# EAGLE design EthernetGCS (EAGLE 6.1)

## Sheet 1 of 2
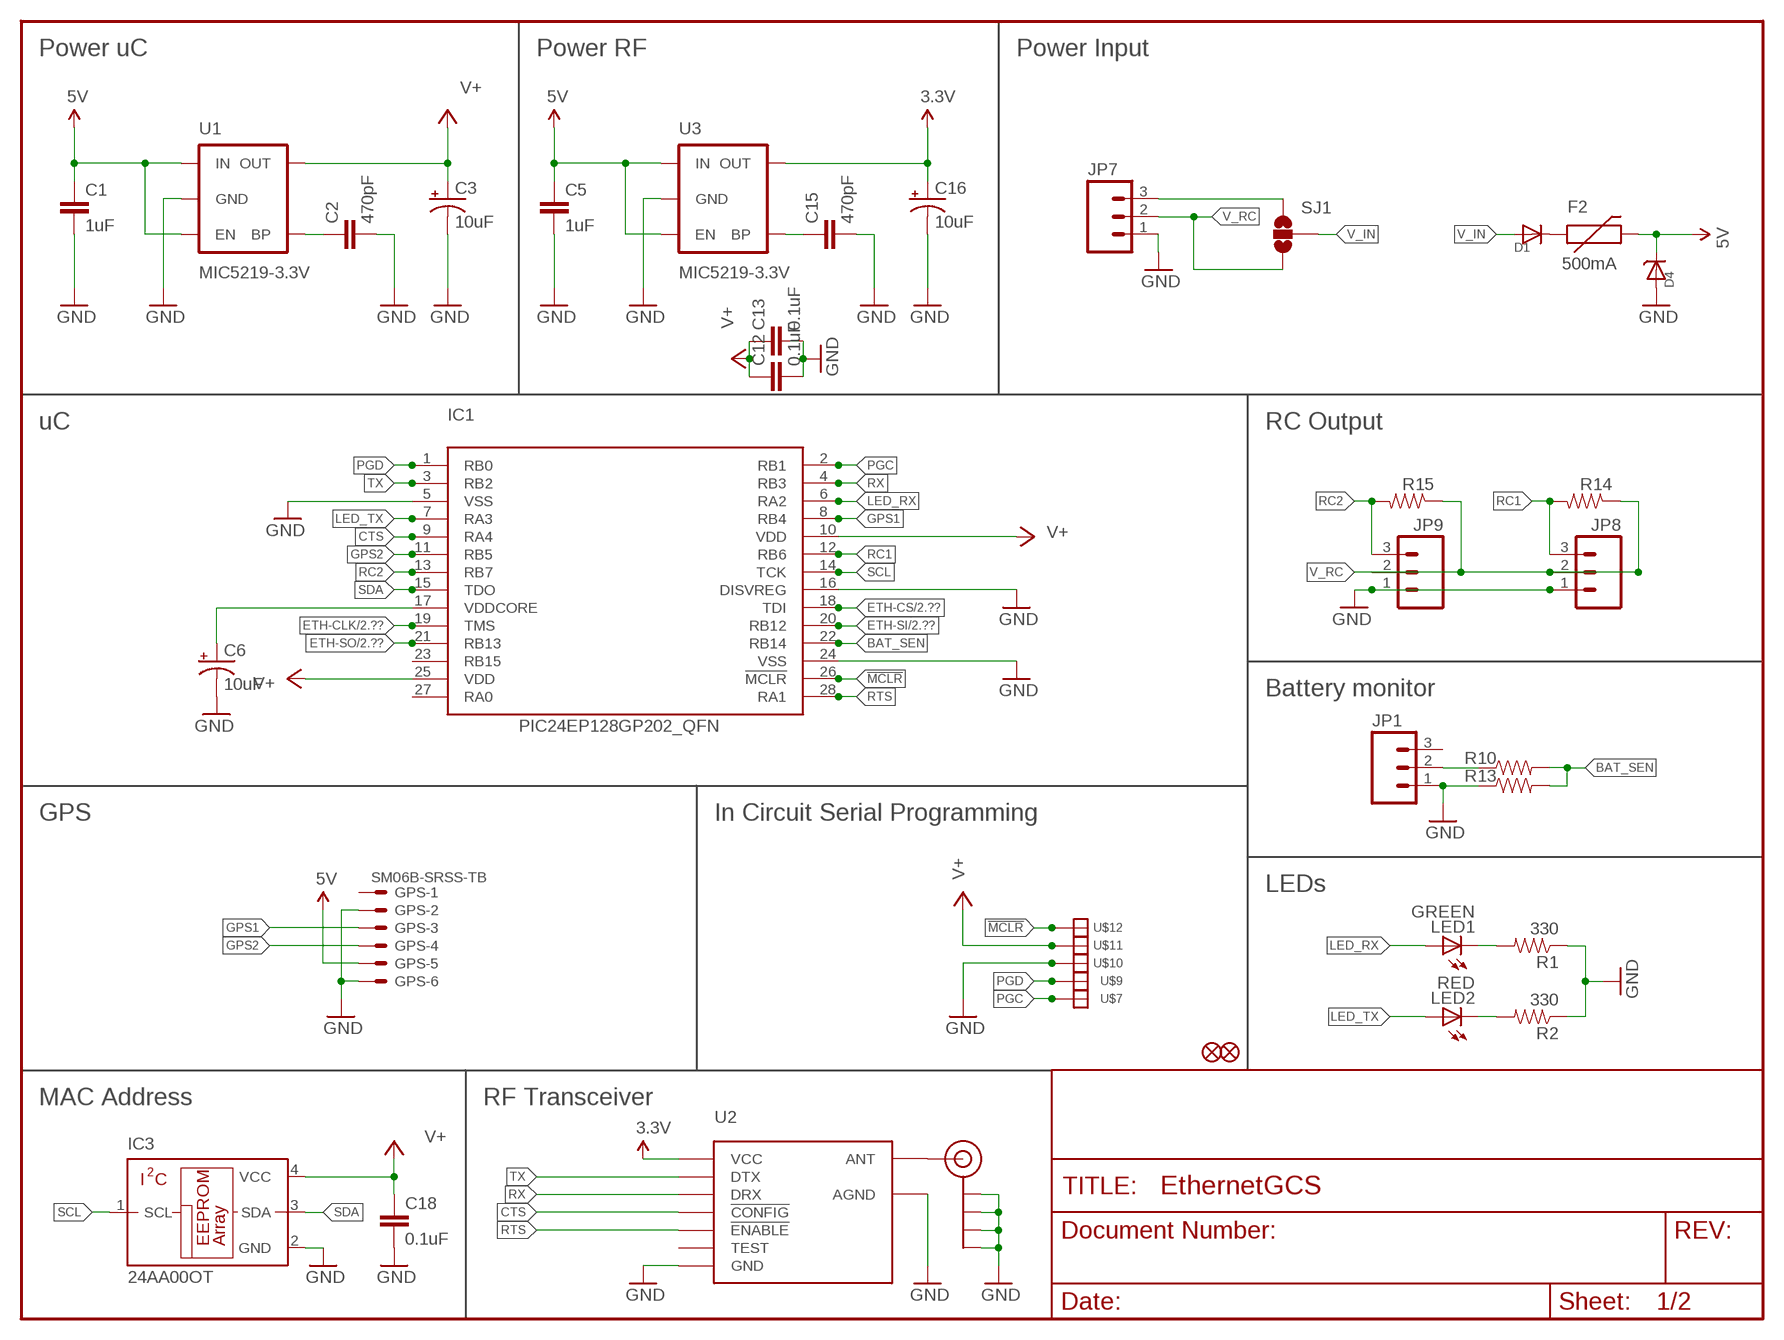
[diagram p0: schematic, sheet 1]

### Parts
C1  1uF  CAP0402-CAP  [0402-CAP]
C2  470pF  CAP0402-CAP  [0402-CAP]
C3  10uF  CAP_POL1206  [EIA3216]
C5  1uF  CAP0402-CAP  [0402-CAP]
C6  10uF  CAP_POL1206  [EIA3216]
C12  0.1uF  CAP0402-CAP  [0402-CAP]
C13  0.1uF  CAP0402-CAP  [0402-CAP]
C15  470pF  CAP0402-CAP  [0402-CAP]
C16  10uF  CAP_POL1206  [EIA3216]
C18  0.1uF  CAP0402-CAP  [0402-CAP]
D1  MBR120VLSFT1G  DIODESOD-123  [SOD-123]
D4  MMSZ5233BT1G  DIODESOD-123  [SOD-123]
F2  500mA  PTCSMD  [PTC-1206]
GPS  SM06B-SRSS-TB  [SM06B-SRSS-TB]
IC1  PIC24EP128GP202_QFN  PIC24FJ64GA002_QFN  [QFN28-ML_6X6MM]
IC3  24AA00OT  [SOT23-5L]
J$1  SMA_EDGE  [SMA-EDGE]
JP1  M03PTH  [1X03]
JP2  FIDUCIAL1X2  [FIDUCIAL-1X2]
JP3  FIDUCIAL1X2  [FIDUCIAL-1X2]
JP7  M03PTH  [1X03]
JP8  M03PTH  [1X03]
JP9  M03PTH  [1X03]
LED1  GREEN  LED0603  [LED-0603]
LED2  RED  LED0603  [LED-0603]
R1  330  RESISTOR0402-RES  [0402-RES]
R2  330  RESISTOR0402-RES  [0402-RES]
R10  RESISTOR0402-RES  [0402-RES]
R13  RESISTOR0402-RES  [0402-RES]
R14  RESISTOR0402-RES  [0402-RES]
R15  RESISTOR0402-RES  [0402-RES]
SJ1  SOLDERJUMPER_2WAYT  [SJ_2]
U1  MIC5219-3.3V  V_REG_LDOSMD  [SOT23-5]
U2  HM-TRPSMD  [HM-TRP-SMD]
U3  MIC5219-3.3V  V_REG_LDOSMD  [SOT23-5]
U$7  SOLDER_PAD150_75  [SOLD_PAD_150_75]
U$9  SOLDER_PAD150_75  [SOLD_PAD_150_75]
U$10  SOLDER_PAD150_75  [SOLD_PAD_150_75]
U$11  SOLDER_PAD150_75  [SOLD_PAD_150_75]
U$12  SOLDER_PAD150_75  [SOLD_PAD_150_75]

### Nets
3.3V: C16.A(+) U2.VCC U3.5(OUT)
5V: C1.1 C5.1 D4.C F2.2 GPS.5 U1.1(IN) U1.3(EN) U3.1(IN) U3.3(EN)
!MCLR: IC1.26(!MCLR) U$12.P$1
BAT_SEN: IC1.22(RB14) R10.2 R13.2
CTS: IC1.9(RA4) U2.!CONFIG
ETH-CLK: IC1.19(TMS) ; also sheet 2
ETH-CS: IC1.18(TDI) ; also sheet 2
ETH-SI: IC1.20(RB12) ; also sheet 2
ETH-SO: IC1.21(RB13) ; also sheet 2
GND: C1.2 C2.2 C3.C(-) C5.2 C6.C(-) C12.2 C13.2 C15.2 C16.C(-) C18.2 D4.A GPS.2 GPS.6 IC1.5(VSS) IC1.16(DISVREG) IC1.24(VSS) IC3.2(GND) J$1.GND@0(GND) J$1.GND@1(GND) J$1.GND@2(GND) J$1.GND@3(GND) JP1.1 JP7.1 JP8.1 JP9.1 R1.1 R2.1 R13.1 U1.2(GND) U2.AGND U2.GND U3.2(GND) U$10.P$1 ; also sheet 2
GPS1: GPS.3 IC1.8(RB4)
GPS2: GPS.4 IC1.11(RB5)
LED_RX: IC1.6(RA2) LED1.A
LED_TX: IC1.7(RA3) LED2.A
N$1: J$1.SIG(SIGNAL) U2.ANT
N$2: C2.1 U1.4(BP)
N$3: C15.1 U3.4(BP)
N$5: C6.A(+) IC1.17(VDDCORE)
N$6: D1.C F2.1
N$8: LED1.C R1.2
N$9: LED2.C R2.2
N$10: JP7.3 SJ1.3
N$11: JP1.2 R10.1
PGC: IC1.2(RB1) U$7.P$1
PGD: IC1.1(RB0) U$9.P$1
RC1: IC1.12(RB6) JP8.3 R14.2
RC2: IC1.13(RB7) JP9.3 R15.2
RTS: IC1.28(RA1) U2.!ENABLE
RX: IC1.4(RB3) U2.DRX
SCL: IC1.14(TCK) IC3.1(SCL)
SDA: IC1.15(TDO) IC3.3(SDA)
TX: IC1.3(RB2) U2.DTX
V+: C3.A(+) C12.1 C13.1 C18.1 IC1.10(VDD) IC1.25(VDD) IC3.4(VCC) U1.5(OUT) U$11.P$1 ; also sheet 2
V_IN: D1.A SJ1.2
V_RC: JP7.2 JP8.2 JP9.2 R14.1 R15.1 SJ1.1
Unconnected: GPS.1 IC1.23(RB15) IC1.27(RA0) JP1.3 U2.TEST

### Notes on the sheet
- Power uC | Power RF | Power Input
- uC | RC Output
- Battery monitor
- GPS | In Circuit Serial Programming
- LEDs
- MAC Address | RF Transceiver

## Sheet 2 of 2
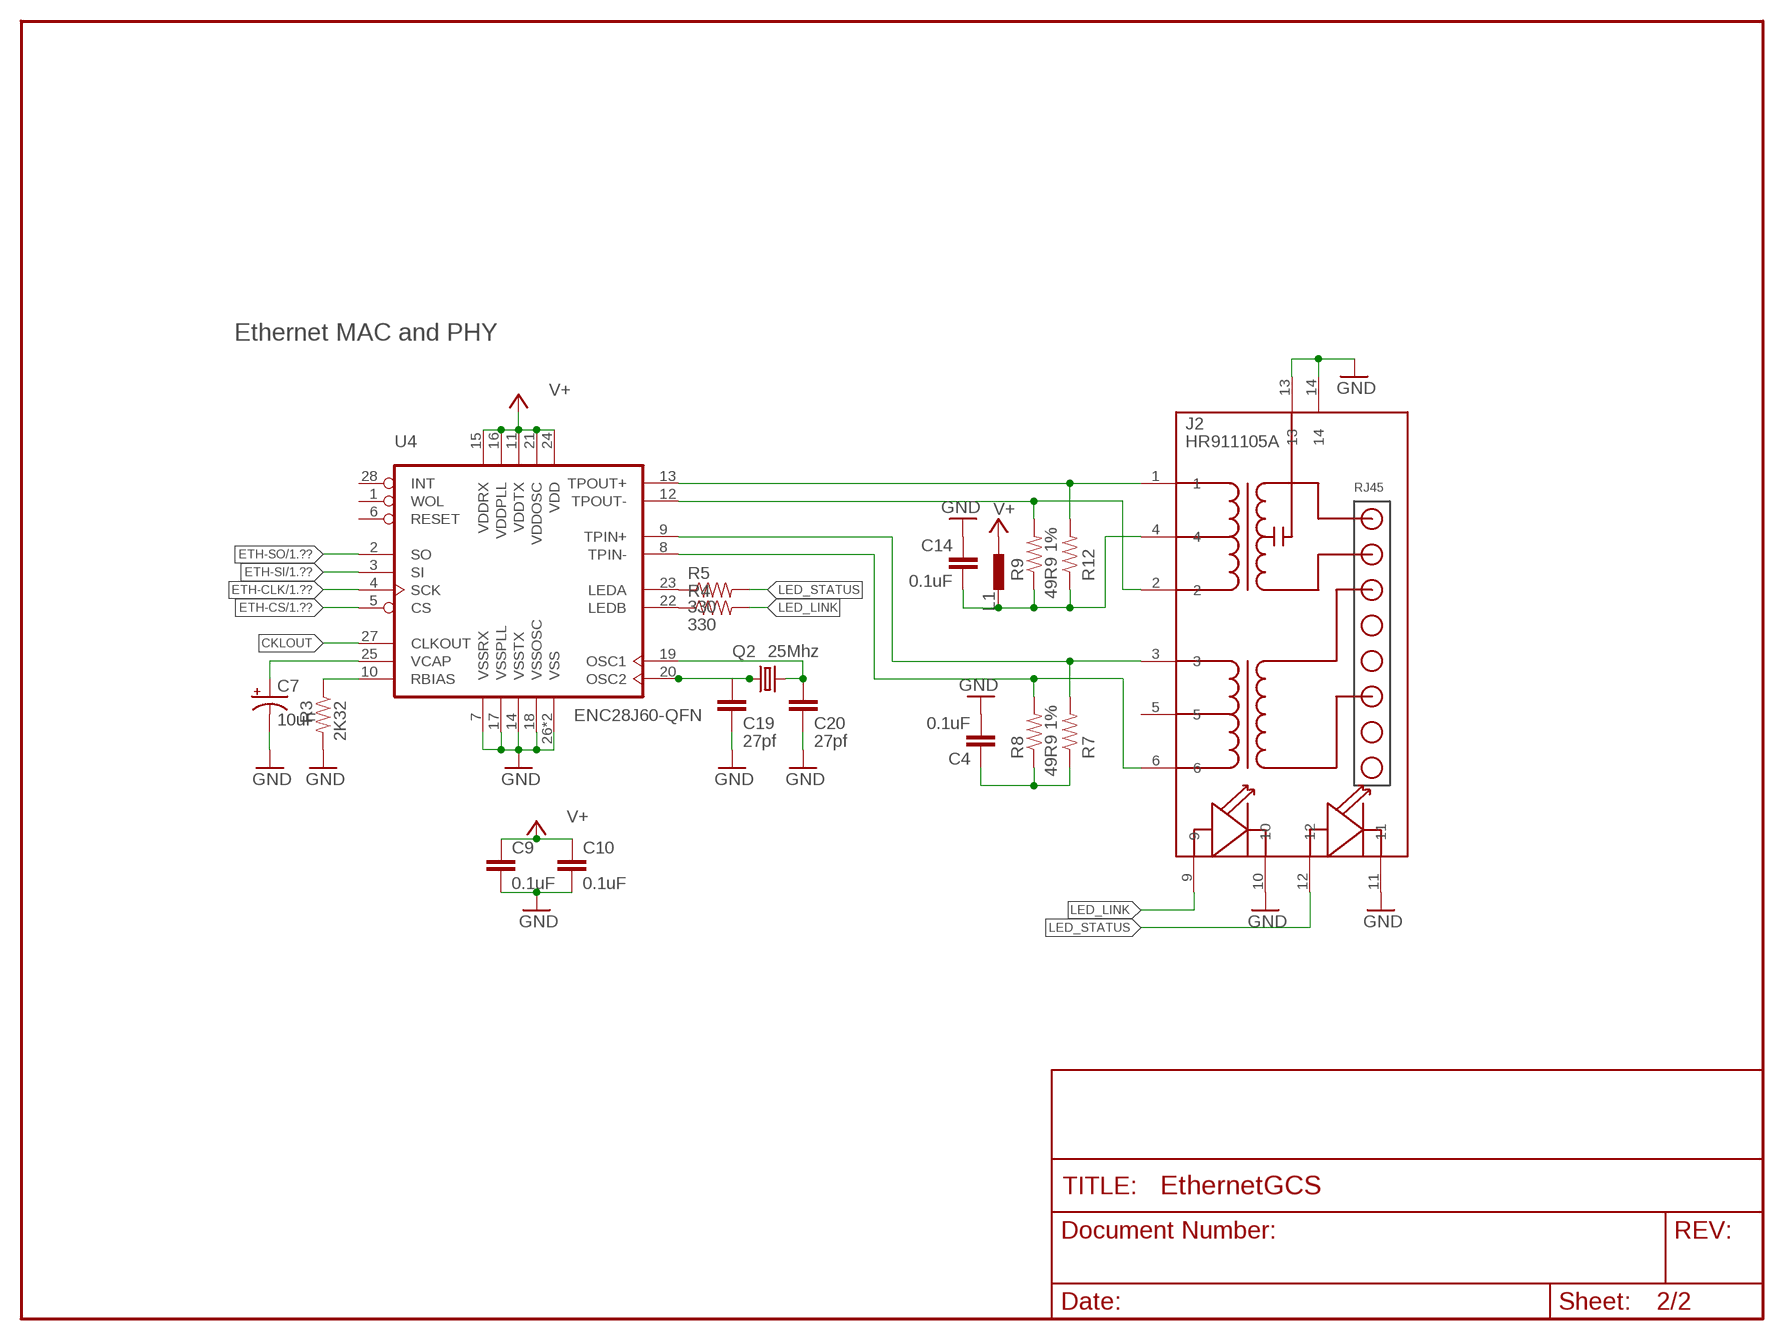
[diagram p1: schematic, sheet 2]

### Parts
C4  0.1uF  CAP0402-CAP  [0402-CAP]
C7  10uF  CAP_POL1206  [EIA3216]
C9  0.1uF  CAP0402-CAP  [0402-CAP]
C10  0.1uF  CAP0402-CAP  [0402-CAP]
C14  0.1uF  CAP0402-CAP  [0402-CAP]
C19  27pf  CAP0402-CAP  [0402-CAP]
C20  27pf  CAP0402-CAP  [0402-CAP]
J2  HR911105A  [HR911105A]
L1  BLM15HD102SN1  INDUCTOR-0402  [0402-IND]
Q2  25Mhz  CRYSTALCTS406  [CTS406]
R3  2K32  RESISTOR0402-RES  [0402-RES]
R4  330  RESISTOR0402-RES  [0402-RES]
R5  330  RESISTOR0402-RES  [0402-RES]
R7  49R9 1%  RESISTOR0402-RES  [0402-RES]
R8  49R9 1%  RESISTOR0402-RES  [0402-RES]
R9  49R9 1%  RESISTOR0402-RES  [0402-RES]
R12  49R9 1%  RESISTOR0402-RES  [0402-RES]
U4  ENC28J60-QFN  [QFN28]

### Nets
CCT: C14.2 J2.4 L1.P$1 R9.1 R12.1
CKLOUT: U4.27(CLKOUT)
ETH-CLK: U4.4(SCK) ; also sheet 1
ETH-CS: U4.5(CS) ; also sheet 1
ETH-SI: U4.3(SI) ; also sheet 1
ETH-SO: U4.2(SO) ; also sheet 1
GND: C4.2 C7.C(-) C9.2 C10.2 C14.1 C19.2 C20.2 J2.10 J2.11 J2.13 J2.14 R3.2 U4.7(VSSRX) U4.14(VSSTX) U4.17(VSSPLL) U4.18(VSSOSC) U4.26(VSS) U4.EXP(VSS) ; also sheet 1
LED_LINK: J2.9 R4.2
LED_STATUS: J2.12 R5.2
N$13: C7.A(+) U4.25(VCAP)
N$14: C19.1 Q2.1 U4.20(OSC2)
N$15: C20.1 Q2.3 U4.19(OSC1)
N$17: R3.1 U4.10(RBIAS)
N$18: R5.1 U4.23(LEDA)
N$19: R4.1 U4.22(LEDB)
N$22: C4.1 R7.1 R8.1
RD+: J2.3 R7.2 U4.9(TPIN+)
RD-: J2.6 R8.2 U4.8(TPIN-)
TD+: J2.1 R12.2 U4.13(TPOUT+)
TD-: J2.2 R9.2 U4.12(TPOUT-)
V+: C9.1 C10.1 L1.P$2 U4.11(VDDTX) U4.15(VDDRX) U4.16(VDDPLL) U4.21(VDDOSC) U4.24(VDD) ; also sheet 1
Unconnected: J2.5 U4.1(WOL) U4.6(RESET) U4.28(INT)

### Notes on the sheet
- Ethernet MAC and PHY

## Library data of the parts
C1 C2 C4 C5 C9 C10 C12-C15 C18-C20 = SparkFun:CAP: Capacitor Standard 0603 ceramic capacitor, and 0.1" leaded capacitor.
C3 C6 C7 C16 = SparkFun:CAP_POL: Capacitor Polarized These are standard SMD and PTH capacitors. Normally 10uF, 47uF, and 100uF in electrolytic and tantalum varieties. Always verify the external diameter of the through hole cap, it varies with capacity, voltage, and manufacturer. The EIA devices should be standard.
D1 D4 = adafruit:DIODE: Diode SMADIODE - SMA Surface Mount Package 20V 1A Schottky Diode Digikey: 641-1014-6-ND DO-1N4148 - Through Hole Small Current Diode SOD-123 20V 1 A (.5mV Vf) Schottky Diode - Digikey: MBRX120TPMSCT-ND SOD-323 10V 570mA (.38mV Vf, 3ns) Schottky Diode - Digikey: ZLLS410CT-ND SOD-523 30V 30mA Schottky Diode (RB751S-40TE61) - Digikey: RB751S-40TE61CT-ND SOT23-R/W - SOT23 Package (R = Solder Paste/Reflow Ovens, W = Hand-Soldering) BAT54Film 40V 300mA - Digikey: 497-7162-1-ND
F2 = SparkFun:PTC: Resettable Fuse PTC Resettable Fuse. Spark Fun Electronics SKU : COM-08357
GPS = con-jst2:?M06B-SRSS-TB: Disconnectable Crimp style connector, 1.0mm pitch 6 contacts
IC1 = microchip:PIC24FJ64GA002_QFN: PIC24FJ64GA002_QFN edit this description Auto generated by make-symbol-device-package-bsdl.ulp Rev. 25 Source: PIC24FJ64GA002_QFN.bsd; MPN: PIC24FJ64GA002-E/ML; OC_FARNELL: 1818728; OC_NEWARK: 98M1922
IC3 = microchip:24*00: Serial EEPROM 128 bit, I2C (AA = 1.8 V/LC = 2.5 V/C = 5.0 V); MF: MICROCHIP; MPN: 24AA00T-I/OTG; OC_FARNELL: 1331264; OC_NEWARK: 89H3038
J2 = CONNECTER:HR911105A
J$1 = 3DRobotics:SMA_EDGE: SMA Antenna Connector End launch SMA connector. The paste layer has been removed so that the connector can be hand soldered onto the board after reflow.
JP1 JP7-JP9 = SparkFun-Connectors:M03: Header 3 Standard 3-pin 0.1" header. Use with straight break away headers (SKU : PRT-00116), right angle break away headers (PRT-00553), swiss pins (PRT-00743), machine pins (PRT-00117), and female headers (PRT-00115). Molex polarized connector foot print use with SKU : PRT-08232 with associated crimp pins and housings.
JP2 JP3 = SparkFun:FIDUCIAL: Fiducial Alignment Points Various fiducial points for machine vision alignment.
L1 = pel_dipol_comp:INDUCTOR
LED1 LED2 = SparkFun:LED: LEDs Standard schematic elements and footprints for 5mm, 3mm, 1206, and 0603 sized LEDs. 5mm - Spark Fun Electronics SKU : COM-00529 (and others)
Q2 = crystal:CRYSTAL: CRYSTAL
R1-R5 R7-R10 R12-R15 = SparkFun:RESISTOR: Resistor Basic schematic elements and footprints for 0603, 1206, and PTH resistors.
SJ1 = SparkFun:SOLDERJUMPER_2WAY: Solder Jumper 2 way solder jumper
U1 U3 = SparkFun:V_REG_LDO: Voltage Regulator LDO Standard 150mA LDO voltage regulator in SOT-23 layout. Micrel part MIC5205. BP (by-pass) pin is used to lower output noise with 470pF cap.
U2 = 3DRobotics:HM-TRP: HM-TRP Series 100mW Transceiver module HM-TRP series is a low cost, high performance transparent FSK transceiver with operating at 433/470/868/915 MHz. It features small size, high output power, high sensitivity, long transmission distance and high communication data rate with auto set up for communication change and data receiving and transmission control. There is UART interface, it is easy to realize the wireless data transmission with only providing the UART data. It is flexible for the users to set the UART baud rate, frequency, output power, data rate, frequency deviation, receiving bandwidth etc parameters. It is your ideal choice for designing wireless data transmission products which can be widely used on wireless data transmission field.
U4 = microchip-enc28j60:ENC28J60-*: Microchip 10Mbit Eth. contoller with SPI interface
U$7 U$9-U$12 = DIYdrones2:SOLDER_PAD

## Net classes
0 default: width 0.178 mm, drill 0.381 mm, clearance 0.178 mm

## Board
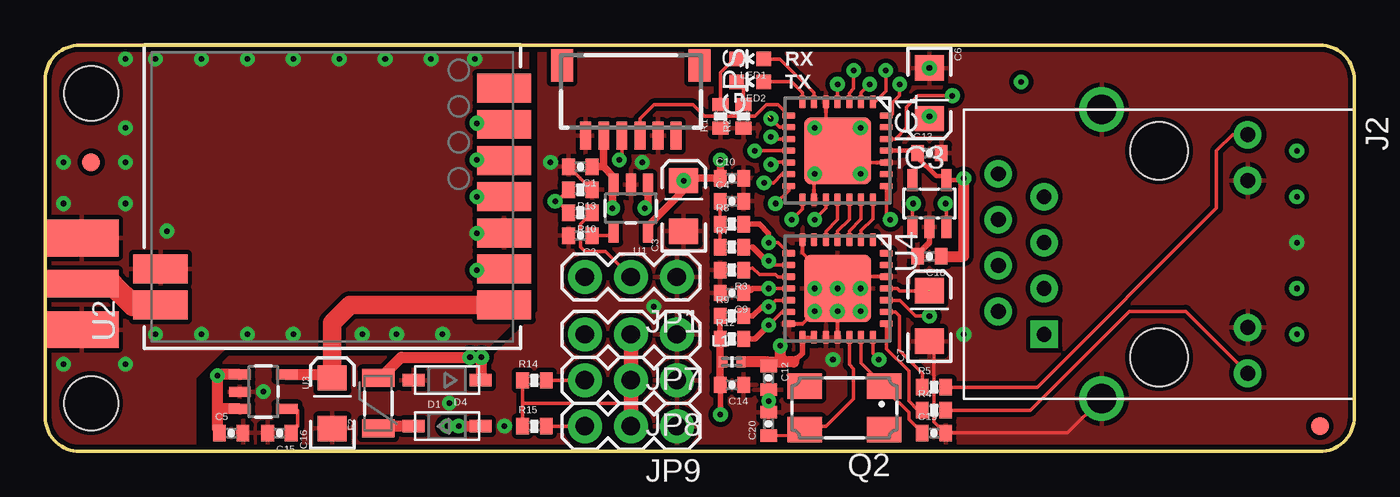
[diagram p2: board, top side]
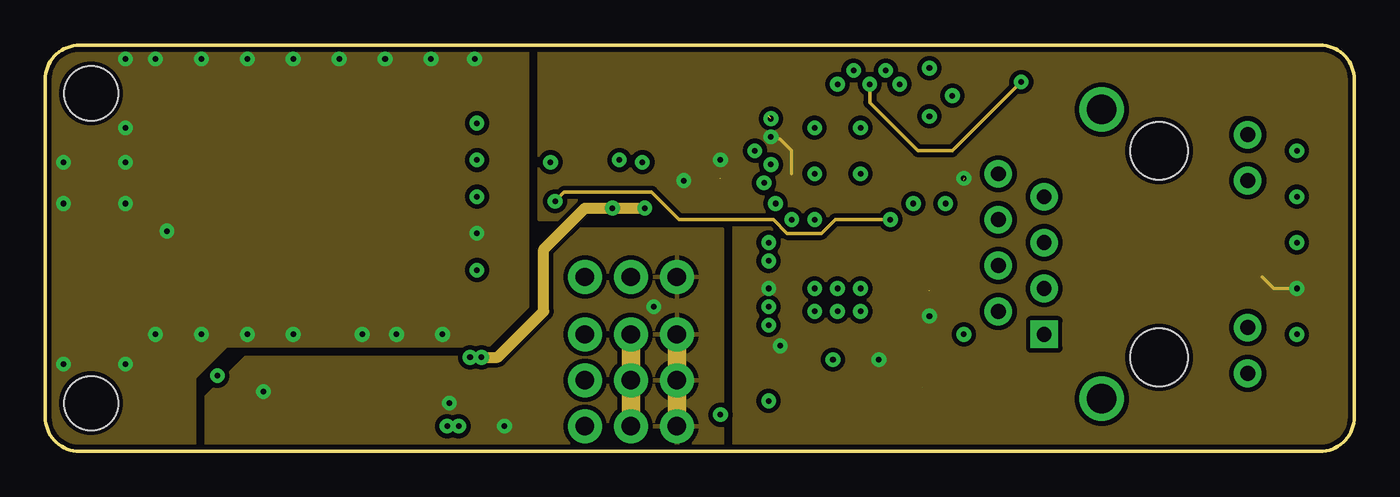
[diagram p3: board, inner layer Route2]
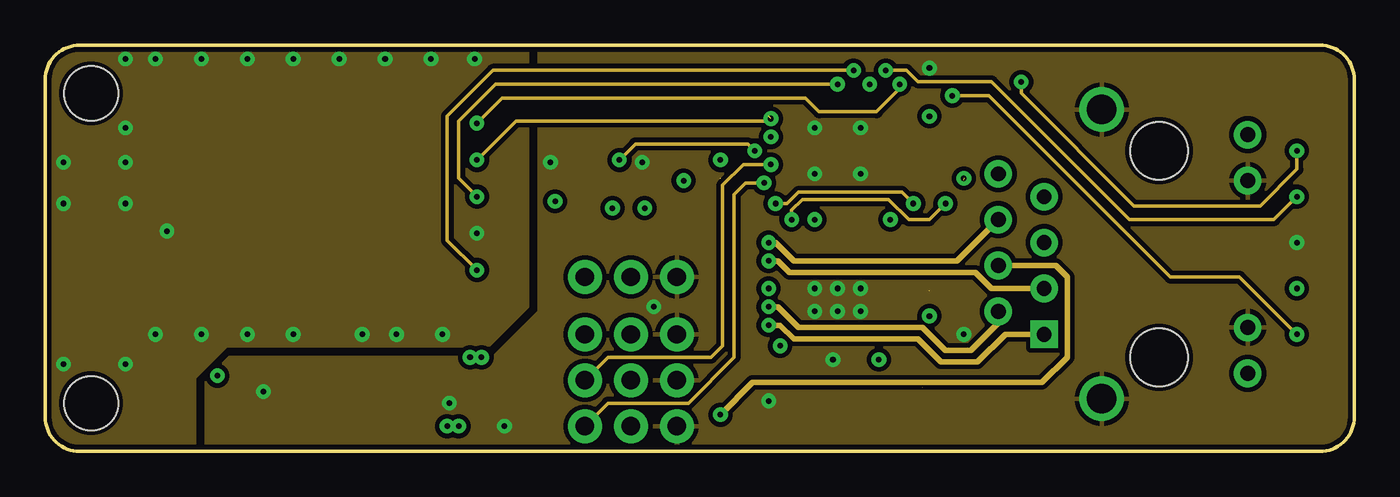
[diagram p4: board, inner layer Route15]
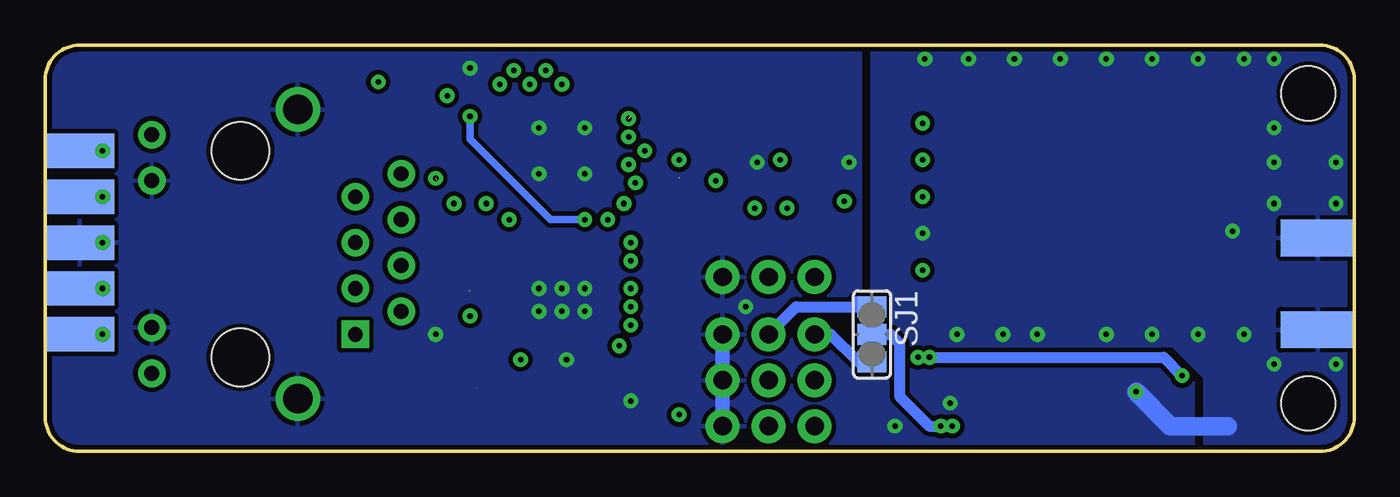
[diagram p5: board, bottom side, seen from below]

Size 72.39 x 22.48 mm. Coordinates in mm from the lower left corner, seen from the top.
Outline: 0,1.91 0,20.57 arc-90 1.91,22.48 70.48,22.48 arc-90 72.39,20.57 72.39,1.91 arc-90 70.48,0 1.91,0 arc-90 0,1.91
Copper layers (1*2*15*16): Top 0.035mm / dielectric 0.5mm / Route2 0.035mm / dielectric 0.5mm / Route15 0.035mm / dielectric 0.5mm / Bottom 0.035mm
Design rules: minimum track width 7mil, minimum drill 8mil, track to track 7mil, track to pad 7mil, pad to pad 7mil, via to via 7mil, smd to smd 0mil, copper to edge 10mil, drill to drill 8mil, minimum pad ring 12mil, minimum via ring 10mil, stop-mask expansion 4mil, vias tented up to drill 25mil, thermal gap 10mil
Holes 3 mm at 2.54,19.81 2.54,2.67

### Footprints (pad centres in the part's own frame; a part is rotated, then mirrored left to right if it is on the bottom)
0402-CAP = smd 0.7 x 0.9: 1 -0.65,0; 2 0.65,0
EIA3216 = smd 1.4 x 1.6: A 1.4,0; C -1.4,0
SOD-123 = smd 1.2 x 0.7: A 1.85,0; C -1.85,0
PTC-1206 = smd 1 x 1.8: 1 -1.4,0; 2 1.4,0
SM06B-SRSS-TB = smd 0.6 x 1.55: 1 -2.5,2.975; 2 -1.5,2.975; 3 -0.5,2.975; 4 0.5,2.975; 5 1.5,2.975; 6 2.5,2.975 | smd 1.2 x 1.8: FIT@1 -3.8,-0.9; FIT@2 3.8,-0.9
QFN28-ML_6X6MM = smd 0.7 x 0.35: 1 -2.7,1.95; 2 -2.7,1.3; 3 -2.7,0.65; 4 -2.7,0; 5 -2.7,-0.65; 6 -2.7,-1.3; 7 -2.7,-1.95; 15 2.7,-1.95; 16 2.7,-1.3; 17 2.7,-0.65; 18 2.7,0; 19 2.7,0.65; 20 2.7,1.3; 21 2.7,1.95 | smd 0.35 x 0.7: 8 -1.95,-2.7; 9 -1.3,-2.7; 10 -0.65,-2.7; 11 0,-2.7; 12 0.65,-2.7; 13 1.3,-2.7; 14 1.95,-2.7; 22 1.95,2.7; 23 1.3,2.7; 24 0.65,2.7; 25 0,2.7; 26 -0.65,2.7; 27 -1.3,2.7; 28 -1.95,2.7 | smd 3.7 x 3.7: EXP 0,0
SOT23-5L = smd 0.55 x 1.2: 1 -0.95,-1.3; 2 0,-1.3; 3 0.95,-1.3; 4 0.95,1.3; 5 -0.95,1.3
HR911105A = drill 0.813 pad 1.524 square: 1 4.445,-6.35 | drill 0.813 pad 1.524: 2 3.175,-8.89; 3 1.905,-6.35; 4 0.635,-8.89; 5 -0.635,-6.35; 6 -1.905,-8.89; 7 -3.175,-6.35; 8 -4.445,-8.89; 9 6.604,4.902; 10 4.064,4.902; 11 -4.064,4.902; 12 -6.604,4.902 | drill 1.651 pad 2.159: 13 8.001,-3.175; 14 -8.001,-3.175 | hole 3.2: 5.715,0; -5.715,0
SMA-EDGE = smd 2.032 x 4.064: GND@0 -2.54,0; GND@1 2.54,0 | smd 2.032 x 4.064 bottom: GND@2 -2.54,0; GND@3 2.54,0 | smd 1.524 x 4.064: SIG 0,0
1X03 = drill 1.016 pad 1.88: 1 0,0; 2 2.54,0; 3 5.08,0
FIDUCIAL-1X2 = smd 1 x 1: 1 0,0
0402-IND = smd 0.5 x 0.6: P$1 -0.5,0; P$2 0.5,0
LED-0603 = smd 0.8 x 0.8: A 0,-0.75; C 0,0.75
CTS406 = smd 1.9 x 1.4: 1 -2.2,-1.2; 2 2.2,-1.2; 3 2.2,1.2; 4 -2.2,1.2
0402-RES = smd 0.7 x 0.9: 1 -0.65,0; 2 0.65,0
SJ_2 = smd 1.168 x 1.6: 1 -1.524,0; 2 0,0; 3 1.524,0
SOT23-5 = smd 0.55 x 1.2: 1 -0.95,-1.3; 2 0,-1.3; 3 0.95,-1.3; 4 0.95,1.3; 5 -0.95,1.3
HM-TRP-SMD = smd 1.6 x 3: !CONFIG 2,-9.5; !ENABLE 4,-9.5; AGND -4,9.5; ANT -6,9.5; DRX 0,-9.5; DTX -4,-9.5; GND -2,-9.5; TEST 6,-9.5; VCC -6,-9.5
QFN28 = smd 0.7 x 0.35: 1 -2.7,1.95; 2 -2.7,1.3; 3 -2.7,0.65; 4 -2.7,0; 5 -2.7,-0.65; 6 -2.7,-1.3; 7 -2.7,-1.95; 15 2.7,-1.95; 16 2.7,-1.3; 17 2.7,-0.65; 18 2.7,0; 19 2.7,0.65; 20 2.7,1.3; 21 2.7,1.95 | smd 0.35 x 0.7: 8 -1.95,-2.7; 9 -1.3,-2.7; 10 -0.65,-2.7; 11 0,-2.7; 12 0.65,-2.7; 13 1.3,-2.7; 14 1.95,-2.7; 22 1.95,2.7; 23 1.3,2.7; 24 0.65,2.7; 25 0,2.7; 26 -0.65,2.7; 27 -1.3,2.7; 28 -1.95,2.7 | smd 3.7 x 3.7: EXP 0,0
SOLD_PAD_150_75 = smd 3.81 x 1.905: P$1 0,0

### Placement (x,y rotation side)
C1  29.59,15.75 180 top
C2  29.59,11.94 180 top
C3  35.31,13.59 90 top
C4  37.97,13.84 0 top
C5  10.29,1.02 0 top
C6  48.9,19.81 270 top
C7  48.9,7.49 90 top
C9  37.97,8.76 180 top
C10  37.97,15.11 0 top
C12  40.01,4.06 270 top
C13  48.9,16.51 0 top
C14  37.97,3.68 180 top
C15  12.95,1.02 180 top
C16  15.88,2.67 90 top
C18  48.9,10.79 180 top
C19  49.15,1.02 0 top
C20  40.01,1.52 90 top
D1  22.23,1.4 0 top
D4  22.23,3.94 180 top
F2  18.41,2.67 90 top
GPS  32.38,20.45 180 top
IC1  43.81,16.64 270 top
IC3  48.9,13.72 0 top
J2  61.59,10.92 270 top
J$1  2.03,9.27 90 top
JP1  34.92,9.65 180 top
JP2  2.54,16 0 top
JP3  70.48,1.4 0 top
JP7  34.92,6.48 180 top
JP8  34.92,3.94 180 top
JP9  34.92,1.4 180 top
L1  37.97,4.95 0 top
LED1  38.99,21.72 90 top
LED2  38.99,20.45 90 top
Q2  44.2,2.41 180 top
R1  37.34,18.54 90 top
R2  38.61,18.54 90 top
R3  37.97,10.03 180 top
R4  49.15,2.29 0 top
R5  49.15,3.56 0 top
R7  37.97,11.3 0 top
R8  37.97,12.57 0 top
R9  37.97,7.49 0 top
R10  29.59,13.21 180 top
R12  37.97,6.22 0 top
R13  29.59,14.48 180 top
R14  27.05,3.94 0 top
R15  27.05,1.4 0 top
SJ1  26.67,6.48 270 bottom
U1  32.38,13.46 180 top
U2  15.88,14.1 90 top
U3  12.06,3.3 270 top
U4  43.81,9.02 270 top
U$7  70.48,16.64 0 bottom
U$9  70.48,14.1 0 bottom
U$10  70.48,11.56 0 bottom
U$11  70.48,9.02 0 bottom
U$12  70.48,6.48 0 bottom

### Tracks (layer width: path | path; a pad name or v marks a point on that pad's centre or on a via)
3.3V
  Top 0.508: U2.VCC 25.41,8.13
  Top 0.61: 15.88,3.94 C16.A 15.69,4.25 U3.5
  Top 1.016: U2.VCC 16.86,8.1 15.88,7.11 C16.A
5V  (via drill 0.3)
  Top 0.203: U1.1 33.34,14.41 | 31.37,14.7 U1.3
  Top 0.406: GPS.5 30.86,17.45 30.86,15.75 | 30.86,15.75 C1.1 30.23,15.75 | U1.3 31.43,15.17 30.86,15.75 | 31.37,14.7 v31.37,13.46 | 33.34,14.41 33.34,13.65 v33.15,13.46
  Top 0.61: D4.C 24.13,3.94 v24.13,5.21 v23.5,5.21 19.68,5.21 18.55,4.07 F2.2 | U3.1 9.59,4.25 v9.53,4.19 9.53,2.41 | U3.3 9.59,2.35 9.53,2.41 | C5.1 9.53,1.25 9.53,2.41
  Route2 0.61: v24.13,5.21 25.02,5.21 27.56,7.75 27.56,11.18 29.84,13.46 v31.37,13.46 v33.15,13.46
  Bottom 0.61: v23.5,5.21 10.54,5.21 v9.53,4.19
!MCLR  (via drill 0.3)
  Top 0.203: IC1.26 47.01,17.29 47.62,17.91 47.62,19.05 48.26,19.68 v50.16,19.68
  Route15 0.203: v50.16,19.68 52.2,19.68 62.23,9.65 66.04,9.65 v69.22,6.48
  Bottom 0.203: v69.22,6.48 U$12.P$1
BAT_SEN  (via drill 0.3)
  Top 0.203: IC1.22 46.52,13.05 v46.74,12.83 | R13.2 29.08,14.48 | 28.69,14.73 R13.2 | v28.19,13.84 28.31,13.84 | 28.31,13.84 R13.2 | 28.31,13.84 R10.2
  Route2 0.203: v28.19,13.84 28.7,14.35 33.53,14.35 35.05,12.83 40.26,12.83 41.02,12.07 42.93,12.07 43.69,12.83 v46.74,12.83
CCT  (via drill 0.3)
  Top 0.305: R9.1 R12.1 | v37.34,2.03 37.34,3.67 C14.2
  Top 0.406: R12.1 37.32,4.95 | 37.32,4.95 37.32,3.7 37.34,3.68 C14.2 | L1.P$1 37.32,4.95
  Route15 0.305: J2.4 55.88,10.29 56.52,9.65 56.52,5.21 55.12,3.81 39.12,3.81 v37.34,2.03
CTS  (via drill 0.3)  (1 unrouted)
  Top 0.203: IC1.9 40.61,17.94 40.01,18.54 | U2.!CONFIG 23.91,16.1 v23.88,16.13
  Route15 0.203: v40.13,18.41 40.13,18.29 26.04,18.29 v23.88,16.13
ETH-CLK
  Top 0.203: IC1.19 44.47,12.84 43.81,12.19 U4.4
ETH-CS
  Top 0.203: U4.5 43.16,12.18 43.81,12.83 IC1.18
ETH-SI
  Top 0.203: U4.3 44.47,12.21 45.12,12.86 IC1.20
ETH-SO
  Top 0.203: U4.2 45.12,12.22 45.77,12.87 IC1.21
GND  (via drill 0.3)
  Top 0.203: U4.7 41.87,10.97 U4.EXP | U4.26 44.47,9.67 U4.EXP | 43.81,6.35 v43.81,7.75 | v43.81,7.75 U4.EXP | 43.78,6.32 43.81,6.35 | U4.18 43.81,6.35 | U4.14 41.87,7.07 v42.55,7.75 v43.81,7.75 | C7.C 49.15,5.84 49.15,1.65 49.78,1.02 C19.2 56.52,1.02 J2.13 | IC1.16 42.52,15.34 v42.55,15.37 | IC1.24 45.1,15.99 45.09,16 | IC1.5 43.16,17.92 43.18,17.91 | R13.1 30.1,14.61 29.21,15.49 29.21,15.62 29.08,15.75 C1.2
  Top 0.254: v42.55,17.91 43.18,17.91 | 45.1,15.99 v45.1,15.38 v45.09,15.37
  Top 0.305: C18.2 48.24,10.91 48.9,11.56 IC3.2
  Route2 1.016: 34.92,1.27 JP8.1 JP7.1
  Bottom 0.203: JP8.1 34.92,2.67
  Bottom 0.813: JP9.1 JP8.1 JP7.1
  Bottom 1.016: v12.06,3.3 10.16,1.4 6.99,1.4
  other vias: 4.45,21.72 6.1,21.72 8.64,21.72 11.18,21.72 13.72,21.72 16.26,21.72 18.8,21.72 21.34,21.72 1.02,16 1.02,13.72 4.45,13.72 4.45,16 4.45,17.91 6.1,6.48 8.64,6.48 11.18,6.48 13.72,6.48 6.73,12.19 17.53,6.48 19.43,6.48 23.88,12.07 23.75,21.72 21.97,6.48 43.81,9.02 45.09,7.75 50.8,6.48 45.09,9.02 42.55,9.02 45.09,17.91 48.9,21.21 40.01,2.79 27.94,16 25.4,1.4 22.35,2.67 33.02,16 33.66,8 69.22,11.56 4.45,4.83 1.02,4.83 43.56,5.08
  pour Top (isolate 0.254): -4.45,-4.32 -4.45,26.16 26.67,26.16 26.67,8 24.51,5.84 10.03,5.84 8.26,4.06 8.26,-4.32
  pour Bottom (isolate 0.254): -2.54,-2.41 -2.54,24.26 26.67,24.26 26.67,8 24.51,5.84 10.03,5.84 8.26,4.06 8.26,-2.41
  pour Top (isolate 0.254): 77.47,-4.32 8.89,-4.32 8.89,3.94 10.16,5.21 10.16,5.21 24.77,5.21 27.3,7.75 27.3,25.91 77.47,25.91
  pour Route15 (isolate 0.254): 76.2,-3.05 8.89,-3.05 8.89,3.94 10.16,5.21 24.77,5.21 27.3,7.75 27.3,24.64 76.2,24.64
  pour Route15 (isolate 0.254): -3.17,-3.05 -3.17,24.89 26.67,24.89 26.67,8 24.51,5.84 10.03,5.84 8.26,4.06 8.26,-3.05
  pour Route2 (isolate 0.254): -3.81,-3.68 -3.81,25.53 26.67,25.53 26.67,8 24.51,5.84 10.03,5.84 8.26,4.06 8.26,-3.68
  pour Bottom (isolate 0.254): 75.56,-2.41 8.89,-2.41 8.89,3.94 10.16,5.21 24.77,5.21 27.3,7.75 27.3,24 75.56,24
  pour Route2 (isolate 0.254): 37.47,12.32 37.47,0.13 8.89,0.13 8.89,3.05 11.05,5.21 25.53,5.21 27.3,6.98 27.3,12.32
GPS1
  Top 0.203: GPS.3 32.88,18.41 33.66,19.18 35.81,19.18 36.45,18.54 39.24,18.54 39.88,19.18 40.51,19.18 IC1.8
GPS2  (via drill 0.3)
  Top 0.203: IC1.11 v39.24,16.64 | GPS.4 31.89,16.26 v31.75,16.13
  Route15 0.203: v39.24,16.64 38.86,17.02 32.64,17.02 v31.75,16.13
LED_LINK
  Top 0.203: R4.2 54.48,2.29 59.94,7.75 63.07,7.75 J2.9
LED_RX
  Top 0.203: IC1.6 42.52,19.84 40.64,21.72 LED1.A
LED_STATUS
  Top 0.203: R5.2 54.86,3.56 64.77,13.46 64.77,16.64 65.66,17.53 J2.12
LED_TX
  Top 0.203: IC1.7 41.87,19.86 41.27,20.45 LED2.A
N$1
  Top 1.219: J$1.SIG 3.68,9.27 4.86,8.1 U2.ANT
N$2
  Top 0.203: C2.1 31.21,11.94 U1.4
N$3
  Top 0.203: C15.1 13.97,1.38 13.97,2.29 13.84,2.41 13.43,2.41 U3.4
N$5  (via drill 0.3)
  Top 0.203: IC1.17 43.16,13.48 v42.55,12.83 | C6.A v48.9,18.54
  Bottom 0.406: v42.55,12.83 44.45,12.83 48.9,17.27 v48.9,18.54
N$6
  Top 0.61: D1.C 18.55,1.4 F2.1
N$8
  Top 0.203: R1.2 37.08,19.18 37.34,19.43 37.34,20.96 38.1,21.72 LED1.C
N$9
  Top 0.203: R2.2 38.61,19.56 38.61,20.08 38.35,20.33 LED2.C
N$10
  Bottom 0.61: SJ1.3 27.43,4.95 28.96,6.48 JP7.3
N$11
  Top 0.203: R10.1 30.23,13.21 29.59,12.57 29.59,11.3 29.84,11.05 30.99,11.05 JP1.2
N$13  (1 unrouted)
  Top 0.203: U4.25 47.12,9.02 47.24,8.89 C7.A
N$14
  Top 0.203: U4.20 45.12,4.89 Q2.1 46.4,3.34 46.35,3.3 46.61,3.3 47.75,2.16 47.75,1.76 C19.1
N$15
  Top 0.203: U4.19 44.47,4.81 44.7,4.57 44.7,2.92 43.18,1.4 42.18,1.4 Q2.3 41.67,0.89 C20.1
N$17
  Top 0.203: R3.1 39.12,10.16 39.5,9.78 40.39,9.78 40.51,9.65 41.13,9.65 | 41.27,9.65 41.13,9.65 | 41.13,9.65 U4.10
N$18  (1 unrouted)
  Top 0.203: U4.23 47.02,7.72 47.24,7.49 47.24,5.59 48.51,4.32 48.51,3.56
N$19
  Top 0.203: U4.22 46.52,5.68 47.75,4.45 47.75,2.79 48.26,2.29 R4.1
N$22
  Top 0.203: R7.1 R8.1 | C4.1 R8.1 | R8.1 37.32,12.33 37.47,12.19 37.47,12.43 R8.1
PGC  (via drill 0.3)
  Top 0.203: IC1.2 45.12,19.84 v45.59,20.32
  Route2 0.203: v45.59,20.32 45.59,19.3 48.26,16.64 50.16,16.64 v53.98,20.45
  Route15 0.203: v53.98,20.45 53.98,19.81 60.2,13.59 67.18,13.59 69.22,15.62 v69.22,16.64
  Bottom 0.203: v69.22,16.64 U$7.P$1
PGD  (via drill 0.3)
  Top 0.203: 46.02,19.48 45.77,19.48 IC1.1 45.88,19.34 46.02,19.48 | 46.02,19.48 46.48,19.94 v46.48,21.08
  Route15 0.203: v46.48,21.08 47.62,21.08 48.26,20.45 52.32,20.45 59.94,12.83 67.94,12.83 v69.22,14.1
  Bottom 0.203: v69.22,14.1 U$9.P$1
RC1  (via drill 0.3)
  Top 0.203: v40.13,15.88 40.26,16 41.1,16 IC1.12 | R14.2 JP8.3
  Route15 0.203: v40.13,15.88 38.61,15.88 37.47,14.73 37.47,5.84 36.83,5.21 31.11,5.21 JP8.3
RC2  (via drill 0.3)
  Top 0.203: R15.2 JP9.3 | IC1.13 40.74,15.34 40.26,14.86 v39.75,14.86
  Route15 0.203: v39.75,14.86 38.73,14.86 38.1,14.22 38.1,5.21 35.56,2.67 31.11,2.67 JP9.3
RD+  (via drill 0.3)
  Top 0.203: R7.2 39.12,11.3 | U4.9 40.23,10.32 v40.01,10.54
  Top 0.305: 39.12,11.3 39.88,10.54 v40.01,10.54
  Route15 0.305: v40.01,10.54 40.51,10.54 41.15,9.91 51.44,9.91 52.32,9.02 J2.3
RD-  (via drill 0.3)
  Top 0.203: v40.01,11.56 40.52,11.56 U4.8
  Top 0.305: R8.2 39.5,12.57 40.01,12.07 v40.01,11.56
  Route15 0.305: v40.01,11.56 40.39,11.56 41.4,10.54 50.42,10.54 J2.6
RTS  (via drill 0.3)
  Top 0.203: 26.1,18.1 U2.!ENABLE 23.94,18.1 v23.88,18.16 | 46.65,18.59 IC1.28 46.56,18.54 46.61,18.54 46.61,18.67 46.86,18.67 46.86,19.3 47.24,19.68 v47.24,20.32
  Route15 0.203: v47.24,20.32 47.24,20.07 45.97,18.8 42.8,18.8 42.04,19.56 25.27,19.56 v23.88,18.16
RX  (via drill 0.3)
  Top 0.203: IC1.4 v43.81,20.32 | U2.DRX v23.88,14.1
  Route15 0.203: v43.81,20.32 24.89,20.32 22.86,18.29 22.86,15.11 v23.88,14.1
SCL  (via drill 0.3)
  Top 0.203: IC1.14 41.12,14.45 v40.39,13.72 | IC3.1 47.95,13.66 v48.01,13.72
  Route15 0.203: v40.39,13.72 41.02,13.72 41.66,14.35 47.37,14.35 v48.01,13.72
SDA  (via drill 0.3)
  Top 0.203: IC1.15 41.87,13.42 v41.27,12.83 | IC3.3 49.84,13.66 v49.78,13.72
  Route15 0.203: v41.27,12.83 41.27,13.35 IC1.15 46.64,13.94 47.75,12.83 48.9,12.83 v49.78,13.72
TD+  (via drill 0.3)
  Top 0.203: U4.13 40.74,7.72 v40.01,6.98
  Top 0.305: v40.01,6.98 39.24,6.22 R12.2
  Route15 0.305: v40.01,6.98 40.64,6.98 41.4,6.22 48.26,6.22 49.53,4.95 51.56,4.95 53.09,6.48 J2.1
TD-  (via drill 0.3)
  Top 0.203: 39.88,7.87 v40.01,8 40.37,8.37 U4.12
  Top 0.305: R9.2 39.12,7.49 39.62,8 v40.01,8
  Route15 0.305: v40.01,8 40.51,8 41.66,6.86 48.51,6.86 49.78,5.59 51.18,5.59 52.7,7.11 J2.2
TX  (via drill 0.3)
  Top 0.203: IC1.3 44.47,19.83 44.7,20.07 v44.7,21.08 | U2.DTX 24.19,10.1 v23.88,10.03
  Route15 0.203: v44.7,21.08 24.77,21.08 22.23,18.54 22.23,11.68 v23.88,10.03
V+  (via drill 0.3)  (2 unrouted)
  Top 0.203: v48.9,7.49 48.13,7.49 47.26,8.37 U4.24 | U4.15 U4.16 | U4.21 45.77,5.42 v46.1,5.08 | v40.01,9.02 U4.11 41.27,9.02 | 50.77,15.02 50.8,14.99 | 39.89,4.71 C12.1 | IC1.10 40.27,17.29 v40.13,17.4 | C3.A 34.92,14.86 34.92,14.73 | 33.4,12.23 U1.5
  Top 0.254: C13.1 48.24,16.27 49.28,15.24 49.62,15.24 IC3.4 50.77,15.02 | IC1.25 48.26,16.64
  Top 0.305: C9.1 39,8.91 39.12,9.02 v40.01,9.02 | 40.01,4.57 C12.1 | U4.15 41.87,5.42 41.53,5.08
  Top 0.406: L1.P$2 38.61,4.95 | 41.4,4.95 41.53,5.08 | C12.1 40.01,4.95 | C10.1 35.18,15.11 34.92,14.86 | 33.4,12.23 33.4,12.54 35.31,14.44 v35.31,14.99 | C13.1 48.24,16.62 48.26,16.64 | v37.34,16.13 37.34,15.11
  Top 0.61: C18.1 50.8,10.79 50.8,14.99 | v40.64,5.84 40.64,5.21 40.89,4.95 | 38.61,4.95 40.01,4.95 40.89,4.95 | 41.4,4.95 40.89,4.95
  Route2 0.203: v40.13,17.4 40.64,17.27 41.27,16.64 41.27,15.37 | v69.22,9.02 67.94,9.02 67.31,9.65
  Bottom 0.203: U$11.P$1 v69.22,9.02
  other vias: 50.8,15.11
  pour Route2 (isolate 0.254): 76.83,-3.68 38.1,-4.32 38.1,12.83 27.3,12.83 27.3,25.27 76.83,25.27
V_IN  (via drill 0.3)
  Top 0.61: v22.86,1.4 24.13,1.45 D1.A
  Bottom 0.61: v22.86,1.4 v22.23,1.4 23.5,1.4 25.15,3.05 25.15,5.97 25.65,6.48 SJ1.2 26.67,5.21
V_RC
  Top 0.203: 26.4,2.68 R15.1 | R14.1 26.4,2.68 | 26.4,2.68 26.42,2.67 32.38,2.67
  Top 0.813: JP7.2 JP8.2 32.38,2.67 JP9.2
  Route2 1.016: JP7.2 JP8.2 JP9.2
  Bottom 0.406: 27.56,8.38 SJ1.1
  Bottom 0.61: JP7.2 30.86,8 SJ1.1

### Text on the board
tPlace: RX | TX